# EAGLE design usbtinyispfzr (EAGLE 5.11)
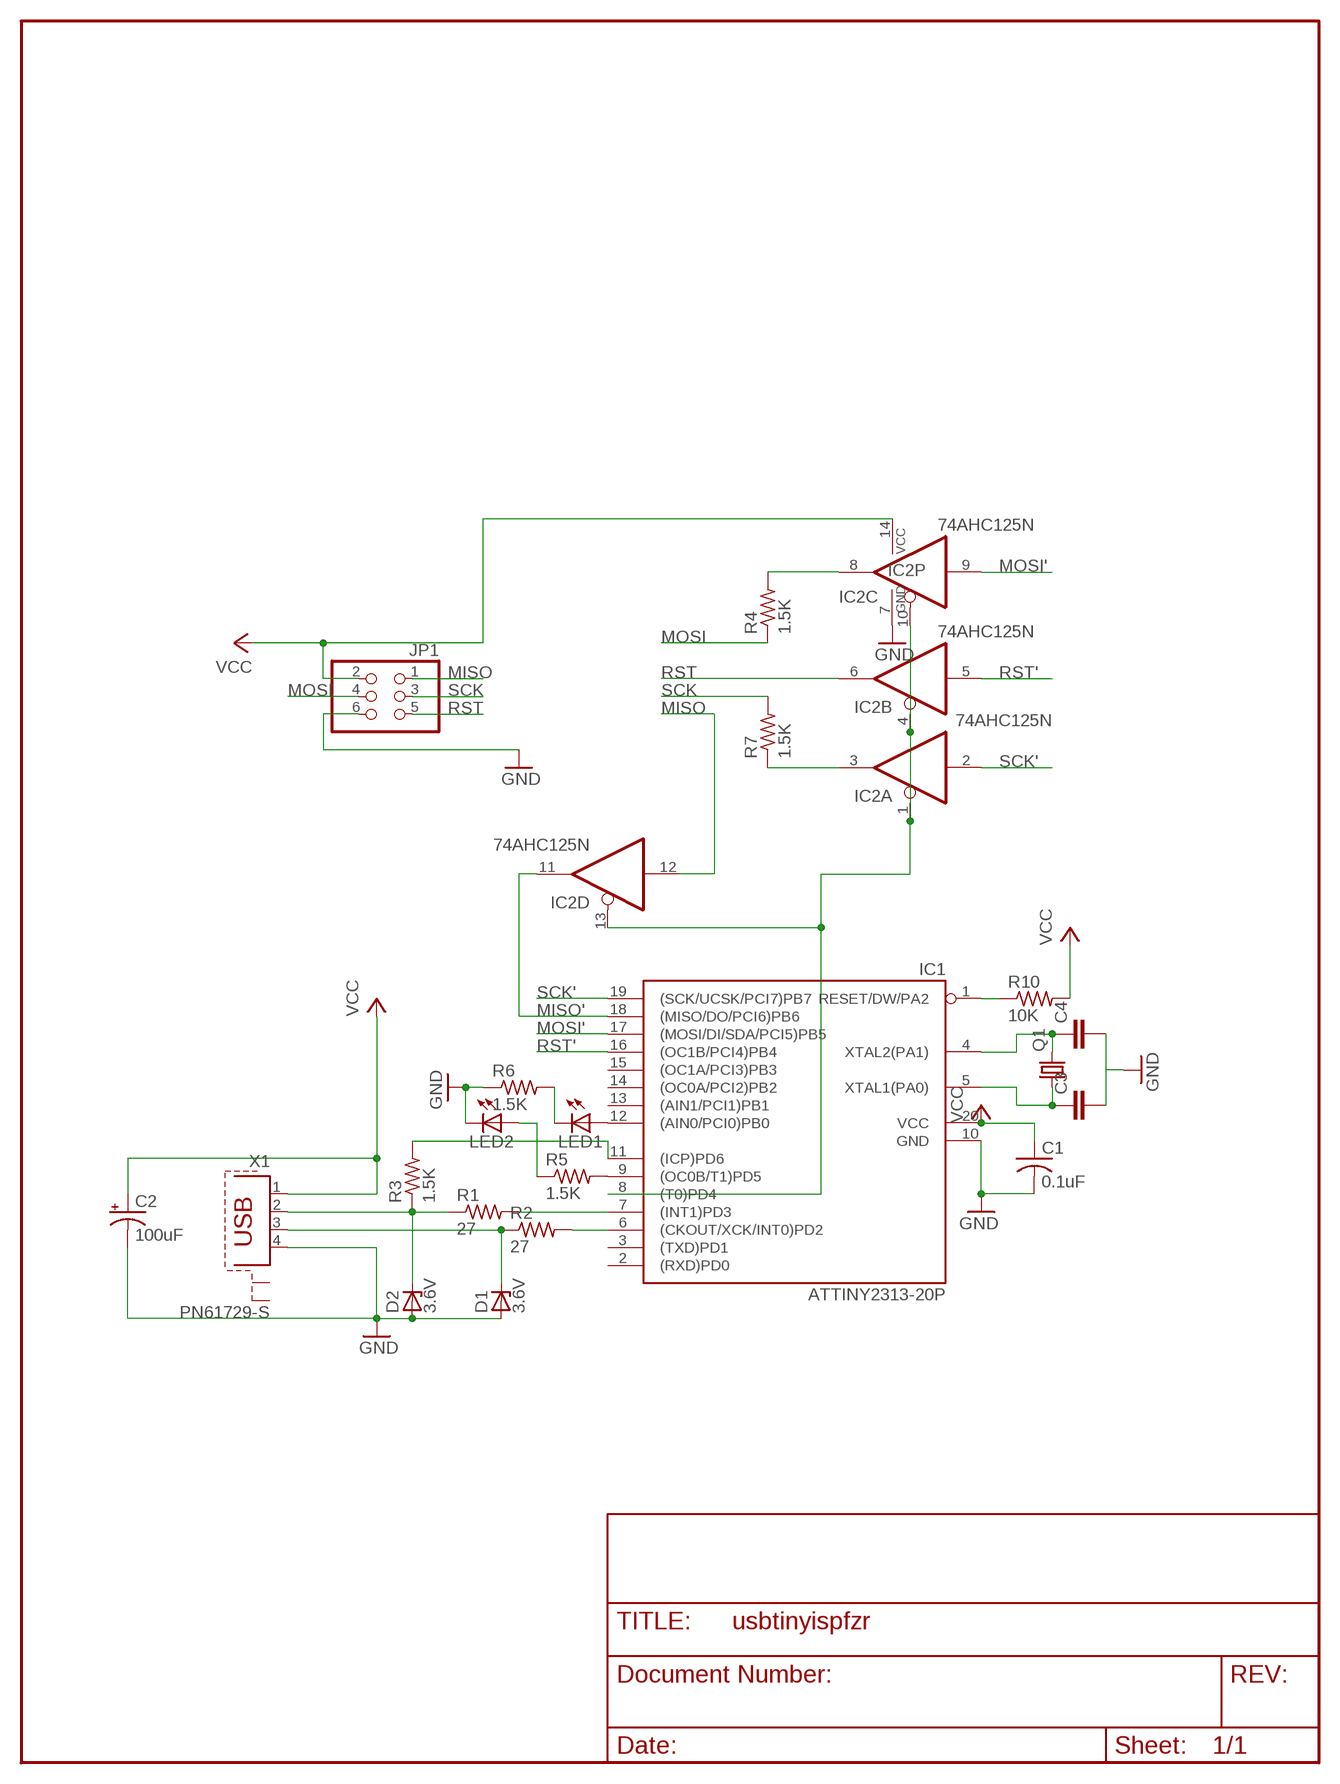
[diagram p0: schematic, sheet 1]

## Parts
C1  0.1uF  C-US025-025X050  [C025-025X050]
C2  100uF  CPOL-USE2.5-5  [E2,5-5]
C3  C2.5/2  [C2.5-2]
C4  C2.5/2  [C2.5-2]
D1  3.6V  ZENER-DIODEDO35Z10  [DO35Z10]
D2  3.6V  ZENER-DIODEDO35Z10  [DO35Z10]
IC1  ATTINY2313-20P  [DIL20]
IC2  74AHC125N  74HC125N  [DIL14]
JP1  PINHD-2X3  [2X03]
LED1  LED3MM  [LED3MM]
LED2  LED3MM  [LED3MM]
Q1  CRYSTALHC49S  [HC49/S]
R1  27  R-US_0204/7  [0204/7]
R2  27  R-US_0204/7  [0204/7]
R3  1.5K  R-US_0204/7  [0204/7]
R4  1.5K  R-US_0204/7  [0204/7]
R5  1.5K  R-US_0204/7  [0204/7]
R6  1.5K  R-US_0204/7  [0204/7]
R7  1.5K  R-US_0204/7  [0204/7]
R10  10K  R-US_0204/7  [0204/7]
X1  PN61729-S  [PN61729-S]

## Nets
GND: C1.2 C2.- C3.2 C4.2 D1.A D2.A IC1.10(GND) IC2.7(P:GND) JP1.6 LED2.K(C) R6.1 X1.4
MISO: IC2.12(D:I) JP1.1
MISO': IC1.18((MISO/DO/PCI6)PB6) IC2.11(D:O)
MOSI: JP1.4 R4.1
MOSI': IC1.17((MOSI/DI/SDA/PCI5)PB5) IC2.9(C:I)
N$1: D2.C R1.1 R3.1 X1.2
N$2: D1.C R2.1 X1.3
N$3: IC1.7((INT1)PD3) R1.2
N$4: C3.1 IC1.5(XTAL1(PA0)) Q1.1
N$5: C4.1 IC1.4(XTAL2(PA1)) Q1.2
N$6: IC1.6((CKOUT/XCK/INT0)PD2) R2.2
N$7: IC1.12((AIN0/PCI0)PB0) LED1.A
N$8: LED1.K(C) R6.2
N$10: IC1.9((OC0B/T1)PD5) R5.2
N$11: LED2.A R5.1
N$12: IC2.3(A:O) R7.1
N$13: IC2.8(C:O) R4.2
N$15: IC1.8((T0)PD4) IC2.1(A:OE) IC2.4(B:OE) IC2.10(C:OE) IC2.13(D:OE)
N$16: IC1.11((ICP)PD6) R3.2
N$18: IC1.1(RESET/DW/PA2) R10.1
RST: IC2.6(B:O) JP1.5
RST': IC1.16((OC1B/PCI4)PB4) IC2.5(B:I)
SCK: JP1.3 R7.2
SCK': IC1.19((SCK/UCSK/PCI7)PB7) IC2.2(A:I)
VCC: C1.1 C2.+ IC1.20(VCC) IC2.14(P:VCC) JP1.2 R10.2 X1.1
Unconnected: IC1.2((RXD)PD0) IC1.3((TXD)PD1) IC1.13((AIN1/PCI1)PB1) IC1.14((OC0A/PCI2)PB2) IC1.15((OC1A/PCI3)PB3) X1.S1 X1.S2

## Library data of the parts
C1 = rcl-ez:C-US: CAPACITOR, American symbol
C2 = rcl-ez:CPOL-US: POLARIZED CAPACITOR, American symbol
C3 C4 = capacitor-wima:C: CAPACITOR naming: grid - package width
D1 D2 = diode:ZENER-DIODE: Z-Diode
IC1 = avr:ATTINY2313: MICROCONTROLLER 2 Kbytes FLASH 128 bytes SRAM 128 bytes EEPROM USART USI
IC2 = 74xx-eu:74*125: Quad bus BUFFER, 3-state
JP1 = pinhead-ez:PINHD-2X3: PIN HEADER
LED1 LED2 = minimidi:LED: LED OSRAM: - CHIPLED LG R971, LG N971, LY N971, LG Q971, LY Q971, LO R971, LY R971 LH N974, LH R974 LS Q976, LO Q976, LY Q976 LO Q996 - Hyper CHIPLED LW Q18S LB Q993, LB Q99A, LB R99A - SideLED LS A670, LO A670, LY A670, LG A670, LP A670 LB A673, LV A673, LT A673, LW A673 LH A674 LY A675 LS A676, LA A676, LO A676, LY A676, LW A676 LS A679, LY A679, LG A679 - Hyper Micro SIDELED® LS Y876, LA Y876, LO Y876, LY Y876 LT Y87S - SmartLED LW L88C, LW L88S LB L89C, LB L89S, LG L890 LS L89K, LO L89K, LY L89K LS L896, LA L896, LO L896, LY L896 - TOPLED LS T670, LO T670, LY T670, LG T670, LP T670 LSG T670, LSP T670, LSY T670, LOP T670, LYG T670 LG T671, LOG T671, LSG T671 LB T673, LV T673, LT T673, LW T673 LH T674 LS T676, LA T676, LO T676, LY T676, LB T676, LH T676, LSB T676, LW T676 LB T67C, LV T67C, LT T67C, LS T67K, LO T67K, LY T67K, LW E67C LS E67B, LA E67B, LO E67B, LY E67B, LB E67C, LV E67C, LT E67C LW T67C LS T679, LY T679, LG T679 LS T770, LO T770, LY T770, LG T770, LP T770 LB T773, LV T773, LT T773, LW T773 LH T774 LS E675, LA E675, LY E675, LS T675 LS T776, LA T776, LO T776, LY T776, LB T776 LHGB T686 LT T68C, LB T68C - Hyper Mini TOPLED® LB M676 - Mini TOPLED Santana® LG M470 LS M47K, LO M47K, LY M47K Source: http://www.osram.convergy.de/
Q1 = crystal:CRYSTAL: CRYSTAL
R1-R7 R10 = rcl:R-US_: RESISTOR, American symbol
X1 = con-berg:PN61729-S: BERG USB connector; OC_FARNELL: unknown; OC_NEWARK: unknown

## Board
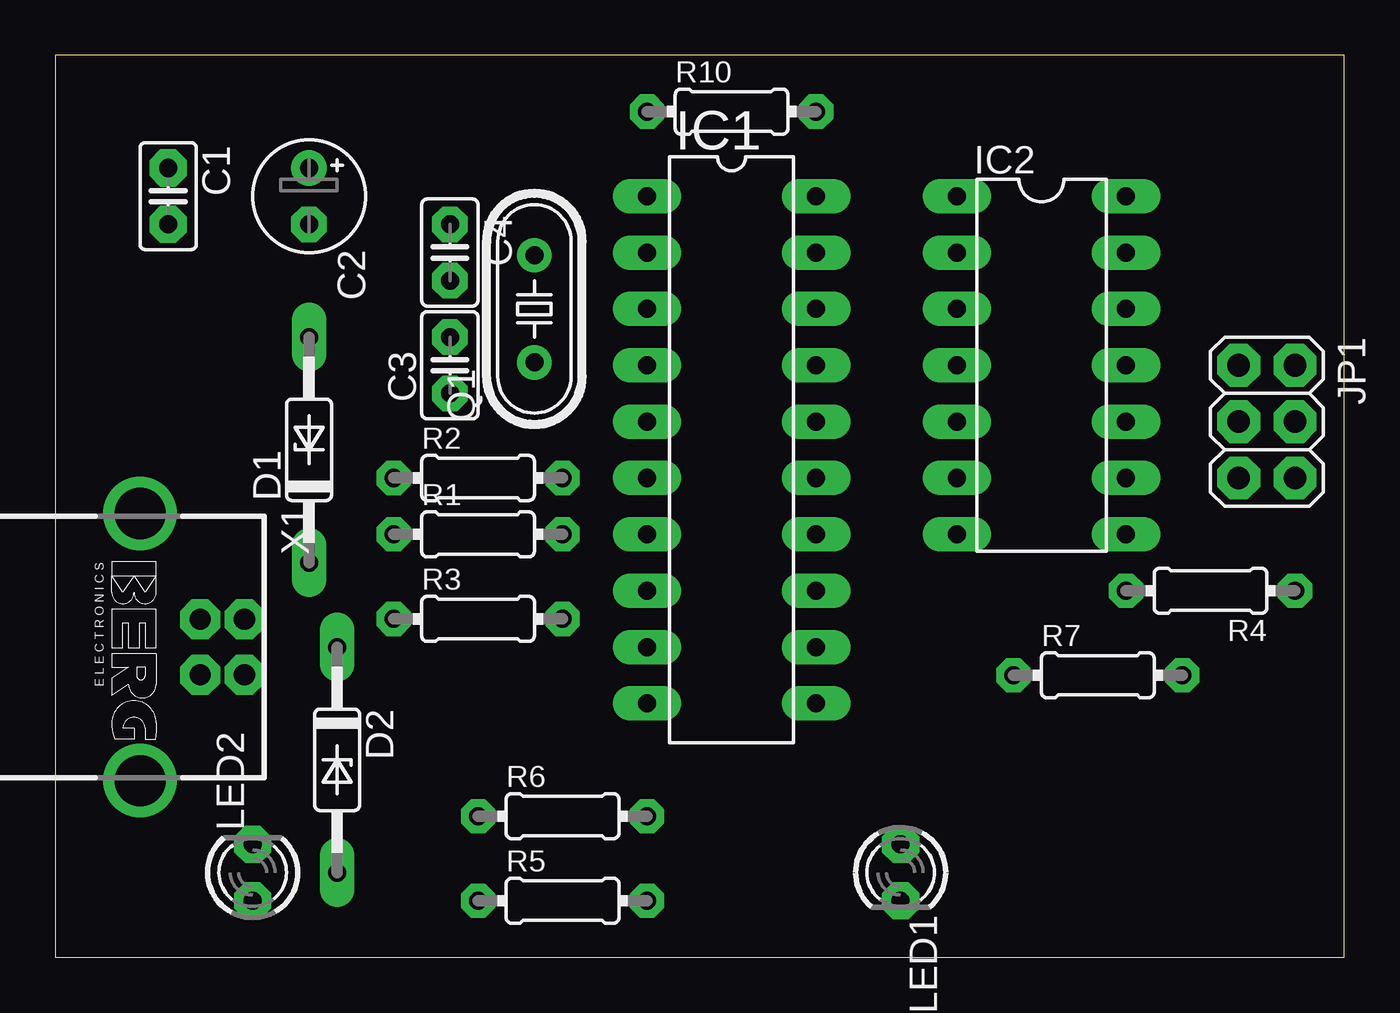
[diagram p1: board, top side]
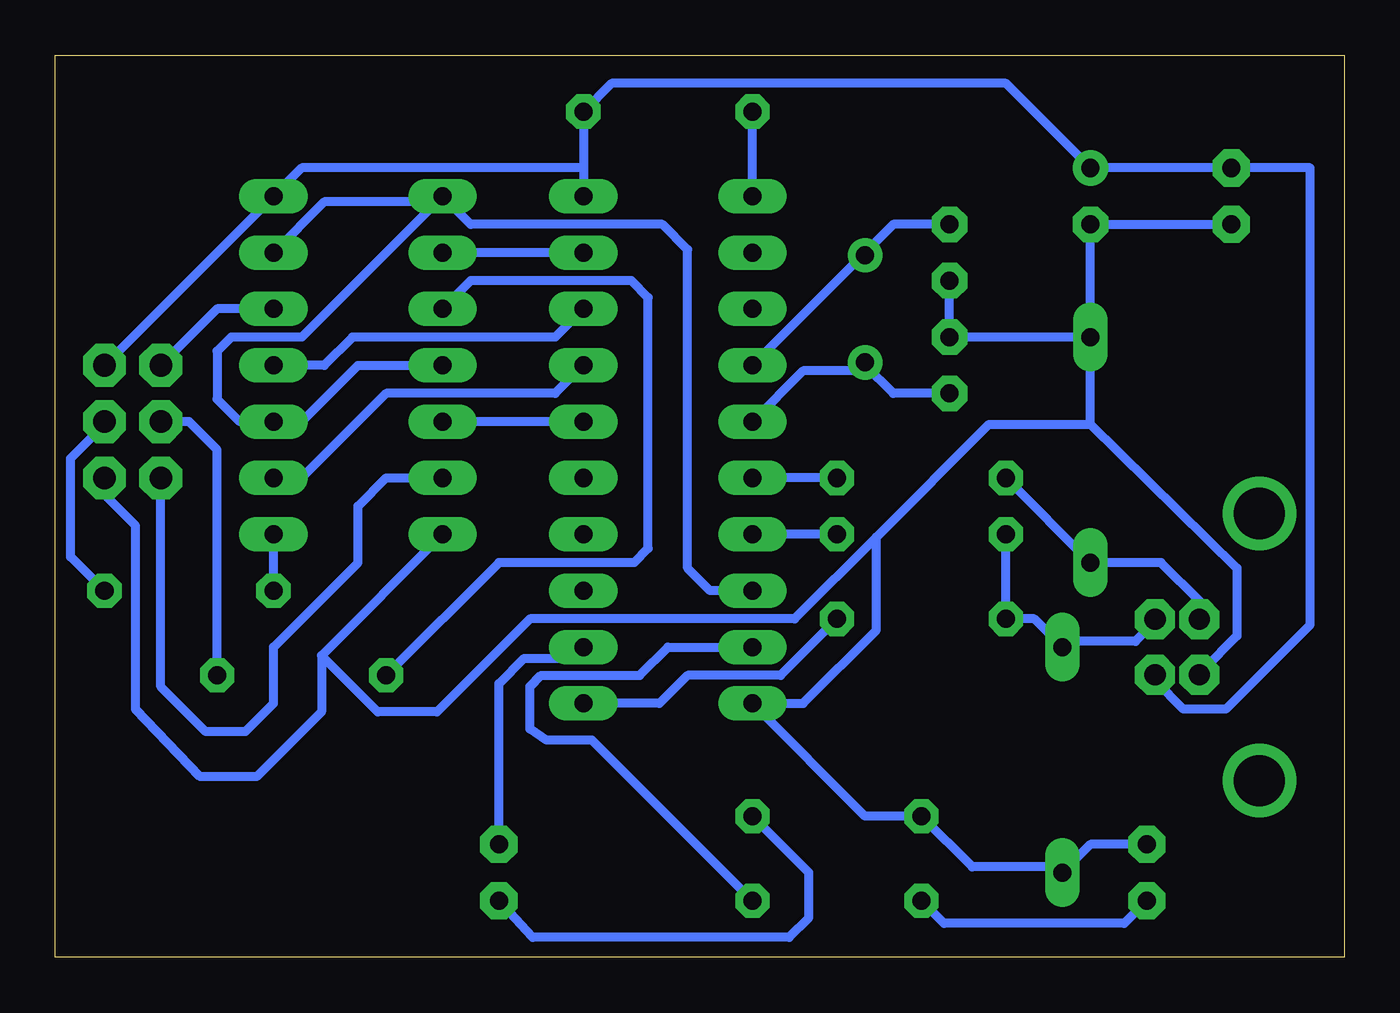
[diagram p2: board, bottom side, seen from below]

Size 58.09 x 40.63 mm. Coordinates in mm from the lower left corner, seen from the top.
Outline: 0,0 58.09,0 58.09,40.63 0,40.63 0,0
Copper layers (1*16): Top 0.035mm / dielectric 1.5mm / Bottom 0.035mm
Design rules "default *": minimum track width 16mil, minimum drill 24mil, track to track 8mil, track to pad 8mil, pad to pad 8mil, via to via 8mil, smd to smd 8mil, copper to edge 40mil, drill to drill 8mil, minimum pad ring 10mil, minimum via ring 8mil, stop-mask expansion 4mil, vias tented up to drill 0mil, thermal gap 10mil

### Footprints (pad centres in the part's own frame; a part is rotated, then mirrored left to right if it is on the bottom)
C025-025X050 = drill 0.813 pad 1.676 octagon: 1 -1.27,0; 2 1.27,0
E2,5-5 = drill 0.813 pad 1.6 round: + -1.27,0 | drill 0.813 pad 1.6 octagon: - 1.27,0
C2.5-2 = drill 0.813 pad 1.6 octagon: 1 -1.27,0; 2 1.27,0
DO35Z10 = drill 0.813 long: A 5.08,0; C -5.08,0
DIL20 = drill 0.813 long: 1 -11.43,-3.81; 2 -8.89,-3.81; 3 -6.35,-3.81; 4 -3.81,-3.81; 5 -1.27,-3.81; 6 1.27,-3.81; 7 3.81,-3.81; 8 6.35,-3.81; 9 8.89,-3.81; 10 11.43,-3.81; 11 11.43,3.81; 12 8.89,3.81; 13 6.35,3.81; 14 3.81,3.81; 15 1.27,3.81; 16 -1.27,3.81; 17 -3.81,3.81; 18 -6.35,3.81; 19 -8.89,3.81; 20 -11.43,3.81
DIL14 = drill 0.813 long: 1 -7.62,-3.81; 2 -5.08,-3.81; 3 -2.54,-3.81; 4 0,-3.81; 5 2.54,-3.81; 6 5.08,-3.81; 7 7.62,-3.81; 8 7.62,3.81; 9 5.08,3.81; 10 2.54,3.81; 11 0,3.81; 12 -2.54,3.81; 13 -5.08,3.81; 14 -7.62,3.81
2X03 = drill 1.016 pad 1.676 octagon: 1 -2.54,-1.27; 2 -2.54,1.27; 3 0,-1.27; 4 0,1.27; 5 2.54,-1.27; 6 2.54,1.27
LED3MM = drill 0.813 pad 1.676 octagon: A -1.27,0; K 1.27,0
HC49/S = drill 0.813 round: 1 -2.413,0; 2 2.413,0
0204/7 = drill 0.813 octagon: 1 -3.81,0; 2 3.81,0
PN61729-S = drill 0.95 octagon: 1 1.25,4.71; 2 -1.25,4.71; 3 -1.25,2.71; 4 1.25,2.71 | drill 2.3 pad 2.9 round: S1 -6.02,0; S2 6.02,0

### Placement (x,y rotation side)
C1  5.08,34.29 270 top
C2  11.43,34.29 270 top
C3  17.78,26.67 90 top
C4  17.78,31.75 270 top
D1  11.43,22.86 90 top
D2  12.7,8.89 270 top
IC1  30.48,22.86 270 top
IC2  44.45,26.67 270 top
JP1  54.61,24.13 270 top
LED1  38.1,3.81 270 top
LED2  8.89,3.81 90 top
Q1  21.59,29.21 90 top
R1  19.05,19.05 0 top
R2  19.05,21.59 0 top
R3  19.05,15.24 0 top
R4  52.07,16.51 180 top
R5  22.86,2.54 0 top
R6  22.86,6.35 0 top
R7  46.99,12.7 0 top
R10  30.48,38.1 0 top
X1  3.81,13.97 270 top

### Tracks (layer width: path | path; a pad name or v marks a point on that pad's centre or on a via)
GND
  Bottom 0.406: LED2.K 11.43,5.08 D2.A 12.7,4.06 16.76,4.06 R6.1 21.59,6.35 IC1.10 24.38,11.43 21.08,14.73 21.08,18.92 | 46.1,13.59 46.1,11.05 49.02,8.13 51.56,8.13 54.48,11.18 54.48,19.43 55.88,20.83 JP1.6 | 46.1,13.59 IC2.7 | C4.2 C3.2 D1.A | D1.A C2.- C1.2 | 11.43,24 4.83,17.53 4.83,14.48 6.35,12.95 X1.4 | 11.43,24 D1.A | 21.08,18.92 16,24 11.43,24 | 21.08,18.92 24.77,15.24 36.7,15.24 40.89,11.05 43.56,11.05 46.1,13.59
MISO
  Bottom 0.406: IC2.12 50.8,29.21 JP1.1
MISO'
  Bottom 0.406: IC1.18 35.56,27.94 44.7,27.94 45.97,26.67 IC2.11
MOSI
  Bottom 0.406: JP1.4 55.88,24 57.4,22.48 57.4,18.03 R4.1
MOSI'
  Bottom 0.406: IC2.9 46.99,21.59 43.18,25.4 35.56,25.4 IC1.17
N$1
  Bottom 0.406: R1.1 R3.1 13.97,15.24 D2.C 12.7,14.22 9.4,14.22 8.64,14.99 X1.2
N$2
  Bottom 0.406: R2.1 D1.C 8.26,17.78 6.48,16 X1.3
N$3
  Bottom 0.406: R1.2 IC1.7
N$4
  Bottom 0.406: C3.1 20.32,25.4 21.59,26.67 Q1.1 21.59,26.42 24.38,26.42 IC1.5
N$5
  Bottom 0.406: C4.1 20.32,33.02 21.59,31.75 Q1.2 21.59,31.5 21.84,31.5 IC1.4
N$6
  Bottom 0.406: R2.2 IC1.6
N$7
  Bottom 0.406: IC1.12 34.8,13.46 36.96,13.46 38.1,12.32 LED1.A
N$8
  Bottom 0.406: R6.2 24.13,3.81 24.13,1.78 25.02,0.89 36.58,0.89 LED1.K
N$10
  Bottom 0.406: R5.2 33.91,9.78 35.94,9.78 36.7,10.29 36.7,12.19 36.2,12.7 31.75,12.7 30.48,13.97 IC1.9
N$11
  Bottom 0.406: R5.1 18.03,1.52 9.91,1.52 LED2.A
N$12
  Bottom 0.406: IC2.3 39.37,30.48 32.13,30.48 31.37,29.72 31.37,18.41 32,17.78 38.1,17.78 R7.1
N$13
  Bottom 0.406: R4.2 IC2.8
N$15
  Bottom 0.406: IC2.4 44.45,26.67 46.99,24.13 IC2.10 49.78,24.13 50.8,25.15 50.8,27.3 50.16,27.94 46.99,27.94 40.89,34.04 | IC1.8 28.57,16.51 29.59,17.53 29.59,31.88 30.73,33.02 39.37,33.02 IC2.1 | IC2.13 45.97,34.04 40.89,34.04 | 40.89,34.04 40.64,34.04 IC2.1 | IC2.1 40.89,34.04
N$16
  Bottom 0.406: R3.2 25.4,12.7 29.59,12.7 30.86,11.43 IC1.11
N$18
  Bottom 0.406: IC1.1 R10.1
RST
  Bottom 0.406: IC2.6 43.18,21.59 44.45,20.32 44.45,17.78 48.26,13.97 48.26,11.43 49.53,10.16 51.31,10.16 53.34,12.19 JP1.5
RST'
  Bottom 0.406: IC1.16 IC2.5
SCK
  Bottom 0.406: R7.2 50.8,22.86 52.07,24.13 JP1.3
SCK'
  Bottom 0.406: IC1.19 IC2.2
VCC
  Bottom 0.406: X1.1 8.51,12.45 7.24,11.18 5.33,11.18 1.52,14.99 1.52,35.56 C1.1 C2.+ 15.24,39.37 33.02,39.37 R10.2 34.29,35.56 | 34.29,35.56 IC1.20 | JP1.2 IC2.14 46.99,35.56 34.29,35.56